# Altium schematic sheet WifiAndPower.SchDoc
size A4
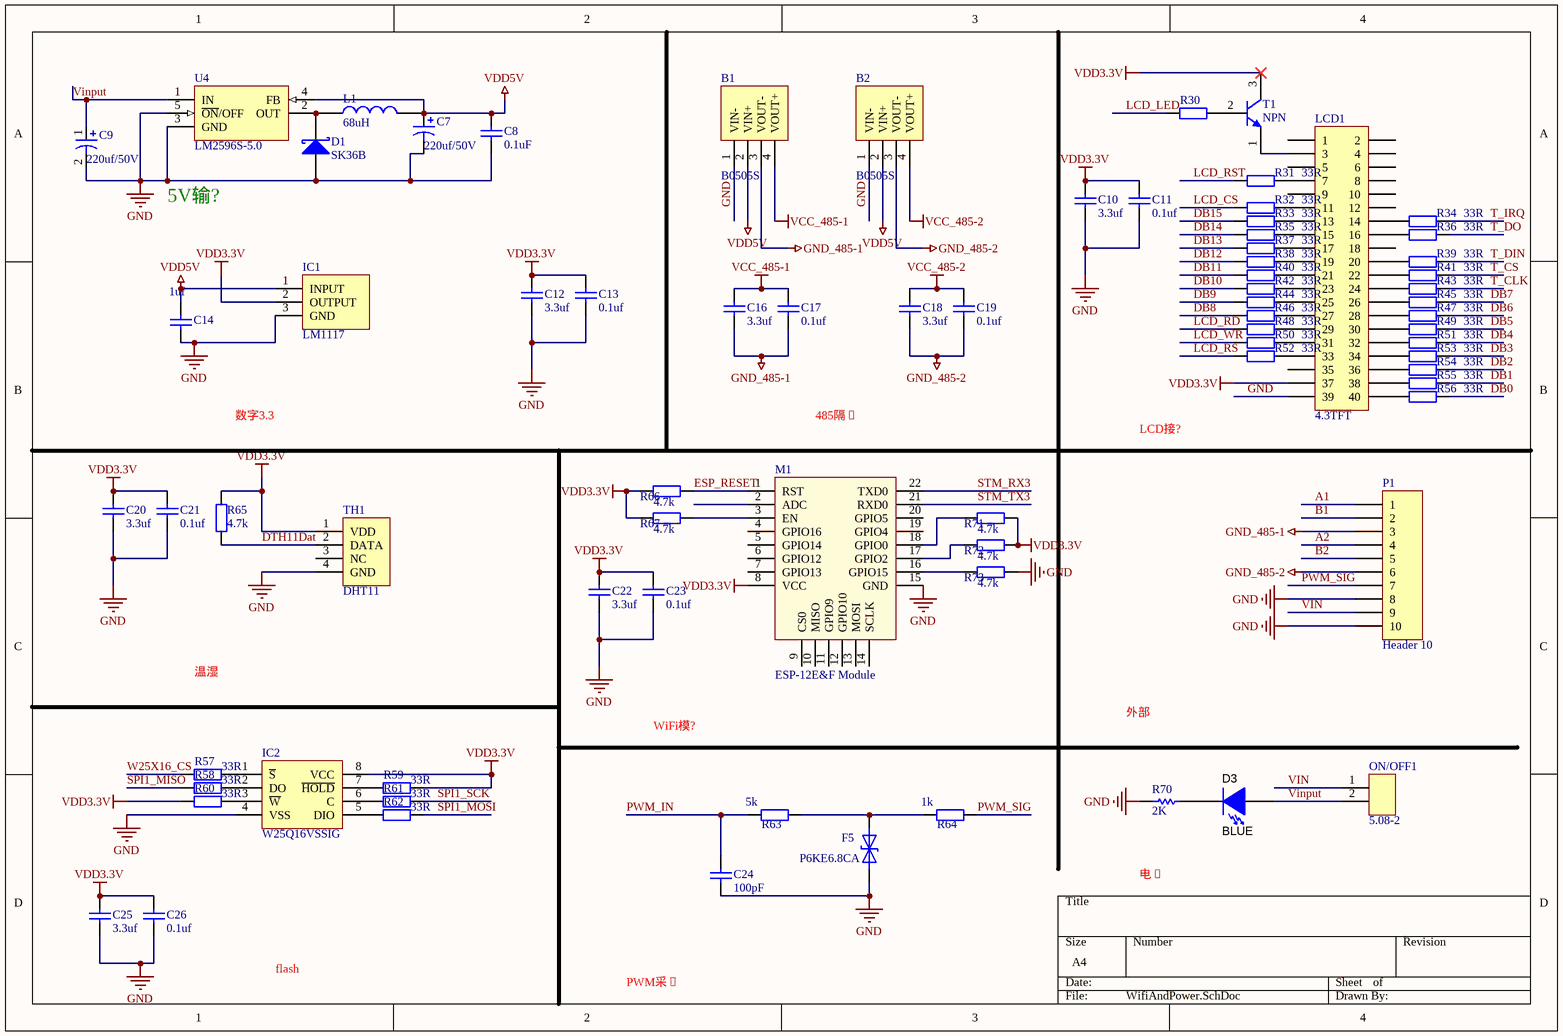
[diagram p0: WifiAndPower.SchDoc]

## Parts
B1  B0505S  [B0505S]
B2  B0505S  [B0505S]
C7  value 220uf/50V  [PLAS8*10]  (hidden comment: Cap Pol1)
C8  value 0.1uF  [C0805]  (hidden comment: Cap)
C9  value 220uf/50V  [PLAS8*10]  (hidden comment: Cap Pol1)
C10  value 3.3uf  [C0805]  (hidden comment: Cap)
C11  value 0.1uf  [C0805]  (hidden comment: Cap)
C12  value 3.3uf  [C0805]  (hidden comment: Cap)
C13  value 0.1uf  [C0805]  (hidden comment: Cap)
C14  value 1uf  [C0805]  (hidden comment: Cap)
C16  value 3.3uf  [C0805]  (hidden comment: Cap)
C17  value 0.1uf  [C0805]  (hidden comment: Cap)
C18  value 3.3uf  [C0805]  (hidden comment: Cap)
C19  value 0.1uf  [C0805]  (hidden comment: Cap)
C20  value 3.3uf  [C0805]  (hidden comment: Cap)
C21  value 0.1uf  [C0805]  (hidden comment: Cap)
C22  value 3.3uf  [C0805]  (hidden comment: Cap)
C23  value 0.1uf  [C0805]  (hidden comment: Cap)
C24  value 100pF  [C0805]  (hidden comment: Cap)
C25  value 3.3uf  [C0805]  (hidden comment: Cap)
C26  value 0.1uf  [C0805]  (hidden comment: Cap)
D1  SK36B  [SMB]
D3  value BLUE  [D0805]  (hidden comment: SML-P12YTT86)
F5  P6KE6.8CA  [P6KE6,8CA]
IC1  LM1117  [LM1117]
IC2  W25Q16VSSIG  [wsop8]
L1  68uH  [PCBH101]
LCD1  4.3TFT  [2.4TFT]
M1  ESP-12E&F Module  [ESP-12E&F Module]
ON/OFF1  5.08-2  [SensorA]
P1  Header 10  [3.5-10]
R30  Res2  [0805]  (value not drawn)
R31  value 33R  [0805]  (hidden comment: Res2)
R32  value 33R  [0805]  (hidden comment: Res2)
R33  value 33R  [0805]  (hidden comment: Res2)
R34  value 33R  [0805]  (hidden comment: Res2)
R35  value 33R  [0805]  (hidden comment: Res2)
R36  value 33R  [0805]  (hidden comment: Res2)
R37  value 33R  [0805]  (hidden comment: Res2)
R38  value 33R  [0805]  (hidden comment: Res2)
R39  value 33R  [0805]  (hidden comment: Res2)
R40  value 33R  [0805]  (hidden comment: Res2)
R41  value 33R  [0805]  (hidden comment: Res2)
R42  value 33R  [0805]  (hidden comment: Res2)
R43  value 33R  [0805]  (hidden comment: Res2)
R44  value 33R  [0805]  (hidden comment: Res2)
R45  value 33R  [0805]  (hidden comment: Res2)
R46  value 33R  [0805]  (hidden comment: Res2)
R47  value 33R  [0805]  (hidden comment: Res2)
R48  value 33R  [0805]  (hidden comment: Res2)
R49  value 33R  [0805]  (hidden comment: Res2)
R50  value 33R  [0805]  (hidden comment: Res2)
R51  value 33R  [0805]  (hidden comment: Res2)
R52  value 33R  [0805]  (hidden comment: Res2)
R53  value 33R  [0805]  (hidden comment: Res2)
R54  value 33R  [0805]  (hidden comment: Res2)
R55  value 33R  [0805]  (hidden comment: Res2)
R56  value 33R  [0805]  (hidden comment: Res2)
R57  value 33R  [0805]  (hidden comment: Res2)
R58  value 33R  [0805]  (hidden comment: Res2)
R59  value 33R  [0805]  (hidden comment: Res2)
R60  value 33R  [0805]  (hidden comment: Res2)
R61  value 33R  [0805]  (hidden comment: Res2)
R62  value 33R  [0805]  (hidden comment: Res2)
R63  value 5k  [0805]  (hidden comment: RES)
R64  value 1k  [0805]  (hidden comment: RES)
R65  value 4.7k  [0805]  (hidden comment: Res2)
R66  value 4.7k  [0805]  (hidden comment: Res2)
R67  value 4.7k  [0805]  (hidden comment: Res2)
R70  value 2K  [0805]  (hidden comment: Res Semi)
R71  value 4.7k  [0805]  (hidden comment: Res2)
R72  value 4.7k  [0805]  (hidden comment: Res2)
R73  value 4.7k  [0805]  (hidden comment: Res2)
T1  NPN  [2N3904]
TH1  DHT11  [DHT11]
U4  LM2596S-5.0  [TS5B_M]

## Nets
GND: B1.1(VIN-) B2.1(VIN-) C7.2 C8.1 C9.2 C10.2 C11.2 C12.2 C13.2 C14.2 C20.2 C21.2 C22.2 C23.2 C24.2 C25.2 C26.2 D1.1(A) F5.2 IC1.3(GND) IC2.4(VSS) LCD1.39 M1.15(GND) P1.8 P1.10 R70.2 R73.1 TH1.4(GND) U4.3(GND) U4.5(~{ON}/OFF)
GND_485-1: B1.3(VOUT-) C16.2 C17.2 P1.3
GND_485-2: B2.3(VOUT-) C18.2 C19.2 P1.6
VCC_485-1: B1.4(VOUT+) C16.1 C17.1
VCC_485-2: B2.4(VOUT+) C18.1 C19.1
VDD3.3V: C10.1 C11.1 C12.1 C13.1 C20.1 C21.1 C22.1 C23.1 C25.1 C26.1 IC1.2(OUTPUT) IC2.8(VCC) LCD1.37 M1.8(VCC) R59.2 R60.1 R65.2 R66.2 R67.2 R71.1 R72.1 T1.3(C) TH1.1(VDD)
VDD5V: B1.2(VIN+) B2.2(VIN+) C7.1 C8.2 C14.1 IC1.1(INPUT) L1.2 U4.4(FB)
A1: P1.1
A2: P1.4
B1: P1.2
B2: P1.5
DB0: R56.2
DB1: R55.2
DB2: R54.2
DB3: R53.2
DB4: R51.2
DB5: R49.2
DB6: R47.2
DB7: R45.2
DB8: R46.1
DB9: R44.1
DB10: R42.1
DB11: R40.1
DB12: R38.1
DB13: R37.1
DB14: R35.1
DB15: R33.1
DTH11Dat: R65.1 TH1.2(DATA)
ESP_RESET: M1.1(RST) R66.1
LCD_CS: R32.1
LCD_LED: R30.1
LCD_RD: R48.1
LCD_RS: R52.1
LCD_RST: R31.1
LCD_WR: R50.1
PWM_IN: C24.1 R63.2
PWM_SIG: P1.7 R64.1
SPI1_MISO: R58.1
SPI1_MOSI: R62.2
SPI1_SCK: R61.2
STM_RX3: M1.22(TXD0)
STM_TX3: M1.21(RXD0)
T_CLK: R43.2
T_CS: R41.2
T_DIN: R39.2
T_DO: R36.2
T_IRQ: R34.2
VIN: ON/OFF1.1 P1.9
Vinput: C9.1 D3.1(A) ON/OFF1.2 U4.1(IN)
W25X16_CS: R57.1
NetD1_2: D1.2(K) L1.1 U4.2(OUT)
NetD3_2: D3.2(K) R70.1
NetF5_1: F5.1 R63.1 R64.2
NetIC2_1: IC2.1(~{S}) R57.2
NetIC2_2: IC2.2(DO) R58.2
NetIC2_3: IC2.3(~{W}) R60.2
NetIC2_5: IC2.5(DIO) R62.1
NetIC2_6: IC2.6(C) R61.1
NetIC2_7: IC2.7(~{HOLD}) R59.1
NetLCD1_3: LCD1.3 T1.1(E)
NetLCD1_7: LCD1.7 R31.2
NetLCD1_11: LCD1.11 R32.2
NetLCD1_13: LCD1.13 R33.2
NetLCD1_14: LCD1.14 R34.1
NetLCD1_15: LCD1.15 R35.2
NetLCD1_16: LCD1.16 R36.1
NetLCD1_17: LCD1.17 R37.2
NetLCD1_19: LCD1.19 R38.2
NetLCD1_20: LCD1.20 R39.1
NetLCD1_21: LCD1.21 R40.2
NetLCD1_22: LCD1.22 R41.1
NetLCD1_23: LCD1.23 R42.2
NetLCD1_24: LCD1.24 R43.1
NetLCD1_25: LCD1.25 R44.2
NetLCD1_26: LCD1.26 R45.1
NetLCD1_27: LCD1.27 R46.2
NetLCD1_28: LCD1.28 R47.1
NetLCD1_29: LCD1.29 R48.2
NetLCD1_30: LCD1.30 R49.1
NetLCD1_31: LCD1.31 R50.2
NetLCD1_32: LCD1.32 R51.1
NetLCD1_33: LCD1.33 R52.2
NetLCD1_34: LCD1.34 R53.1
NetLCD1_36: LCD1.36 R54.1
NetLCD1_38: LCD1.38 R55.1
NetLCD1_40: LCD1.40 R56.1
NetM1_3: M1.3(EN) R67.1
NetM1_16: M1.16(GPIO15) R73.2
NetM1_17: M1.17(GPIO2) R72.2
NetM1_18: M1.18(GPIO0) R71.2
NetR30_2: R30.2 T1.2(B)

Not connected (* = marked no-connect by the designer): LCD1 1 2 4 5 6 8 9 10 12 18 35; M1 2(ADC) 4(GPIO16) 5(GPIO14) 6(GPIO12) 7(GPIO13) 9(CS0) 10(MISO) 11(GPIO9) 12(GPIO10) 13(MOSI) 14(SCLK) 19(GPIO4) 20(GPIO5); TH1 3(NC)

## Notes on the sheet
- 5V输?
- 数字3.3
- 485隔�
- LCD接?
- 温湿
- 外部
- WiFi模?
- 电�
- flash
- PWM采�

## Library data of the parts
C7 C9 = Cap Pol1: Polarized Capacitor (Radial); Published: 8-Jun-2000; LatestRevisionDate: 17-Jul-2002; LatestRevisionNote: Re-released for DXP Platform.; PackageReference: RB7.6-15; Publisher: Altium Limited
C8 = Cap_2: Capacitor; Published: 8-Jun-2000; LatestRevisionDate: 17-Jul-2002; LatestRevisionNote: Re-released for DXP Platform.; Publisher: Altium Limited
C10-C14 C16-C26 = Cap: Capacitor; Manufacturer: Generic Components; Class: Passive; Published: 08/06/2000; Publisher: Altium Hobart Technology Centre; SubClass: Capacitor
D1 = D Schottky: Schottky Diode; Published: 8-Jun-2000; LatestRevisionDate: 17-Jul-2002; LatestRevisionNote: Re-released for DXP Platform.; PackageReference: SMB; Publisher: Altium Limited; Code_JEDEC: DO-214-AA
D3 = SML-P12YTT86: LED, GREEN SMD; Manufacturer: Rohm; Type: InGaN; Vf_V: 2.1; Value2: 2.1V; Io_A: 0.02; Tjmax_C: 85; Value1: W; Color: yellow; U/M: EA; CompType: LED; PartNumber: SML-P12YTT86; SymbolVersion: 2008-12-08; MountType: SMT; RoHS: Y; PackageReference: Yellow LED; Published: 2008-07-11; Publisher: Texas Instruments; ComponentLink1URL: http://rohmfs.rohm.com/en/products/databook/datasheet/opto/led/chip_mono/sml-p1.pdf; ComponentLink1Description: Datasheet link; LatestRevisionDate: 2013-06-24; LatestRevisionNote: Updated supplier queries; Supplier 1: Digi-Key; Supplier Part Number 1: 511-1595-1-ND; Supplier 2: Mouser; Supplier Part Number 2: 755-SML-P12YTT86; Supplier 3: Farnell; Supplier Part Number 3: 1973107
F5 = TVS: 快速瞬变二极管
IC2 = A25L080
L1 = INDUCT
P1 = Header 10: Header, 10-Pin; LatestRevisionDate: 17-Jul-2002; LatestRevisionNote: Re-released for DXP Platform.; Publisher: Altium Limited
R30 = RES: Value: 1K
R31-R62 R65-R67 R71-R73 = RES
R70 = Res Semi: Semiconductor Resistor; Published: 8-Jun-2000; LatestRevisionDate: 17-Jul-2002; LatestRevisionNote: Re-released for DXP Platform.; PackageReference: AXIAL-0.5; Publisher: Altium Limited
U4 = LM2596S-5.0: Simple Switcher Power Converter 150 kHz 3A Step Down Voltage Regulator; Note: Tab is connected to GND; Published: 15-Apr-2002; DatasheetVersion: Dec-1997; PackageReference: TS5B; Publisher: Altium Limited; PackageDescription: D2-PAK; 5 Leads; Body 14.4 (inc. leads) x 10.4 mm (LxW max); ComponentLink1Description: Manufacturer Link; ComponentLink1URL: http://www.national.com/; ComponentLink2Description: Datasheet; ComponentLink2URL: http://www.national.com/ds.cgi/LM/LM2596.pdf; ComponentLink3Description: URL Link1; ComponentLink3URL: http://www.national.com/pf/LM/LM2596.html